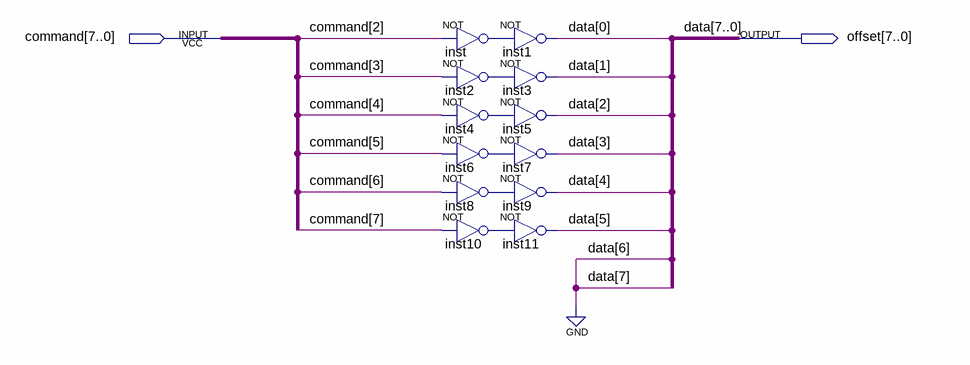
[diagram p0: schematic sheet]
// Quartus schematic offset.bdf as structural Verilog: 12 symbols, 2 pins
module offset (
  input  [7:0] command,
  output [7:0] offset
);

  wire inst2_out, inst4_out, inst6_out, inst8_out, inst10_out, inst_out;

  not inst (inst_out, command[2]);
  not inst2 (inst2_out, command[3]);
  not inst4 (inst4_out, command[4]);
  not inst6 (inst6_out, command[5]);
  not inst8 (inst8_out, command[6]);
  not inst10 (inst10_out, command[7]);
  not inst1 (offset[0], inst_out);
  not inst3 (offset[1], inst2_out);
  not inst5 (offset[2], inst4_out);
  not inst7 (offset[3], inst6_out);
  not inst9 (offset[4], inst8_out);
  not inst11 (offset[5], inst10_out);

  assign offset[7:6] = 2'b00;

  // Other names for the same wires on the sheet: data[5:0] = offset[5:0]
endmodule
